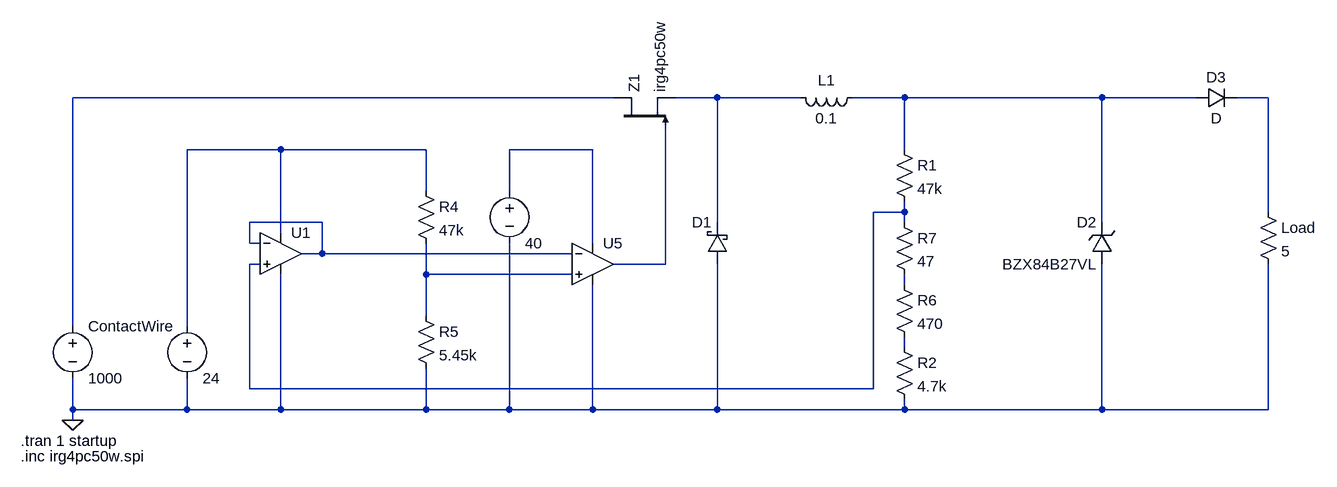
[diagram p0: schematic dc_dc_converter_simple_controller.asc]
dc_dc_converter_simple_controller.asc, the LTspice schematic file:
Version 4
SHEET 1 5120 680
WIRE 2864 -288 2032 -288
WIRE 3024 -288 2960 -288
WIRE 3152 -288 3024 -288
WIRE 3312 -288 3232 -288
WIRE 3616 -288 3312 -288
WIRE 3760 -288 3616 -288
WIRE 3872 -288 3824 -288
WIRE 2352 -208 2208 -208
WIRE 2576 -208 2352 -208
WIRE 2832 -208 2704 -208
WIRE 3312 -208 3312 -288
WIRE 2576 -144 2576 -208
WIRE 2704 -144 2704 -208
WIRE 3312 -112 3312 -128
WIRE 3312 -112 3264 -112
WIRE 3872 -112 3872 -288
WIRE 2416 -96 2304 -96
WIRE 3024 -96 3024 -288
WIRE 3312 -96 3312 -112
WIRE 3616 -96 3616 -288
WIRE 2352 -80 2352 -208
WIRE 2304 -64 2304 -96
WIRE 2320 -64 2304 -64
WIRE 2832 -64 2832 -208
WIRE 2416 -48 2416 -96
WIRE 2416 -48 2384 -48
WIRE 2800 -48 2416 -48
WIRE 2320 -32 2304 -32
WIRE 2944 -32 2944 -240
WIRE 2944 -32 2864 -32
WIRE 2576 -16 2576 -64
WIRE 2800 -16 2576 -16
WIRE 3312 0 3312 -16
WIRE 2576 48 2576 -16
WIRE 2032 64 2032 -288
WIRE 2208 64 2208 -208
WIRE 3312 96 3312 80
WIRE 2304 160 2304 -32
WIRE 3264 160 3264 -112
WIRE 3264 160 2304 160
WIRE 2032 192 2032 144
WIRE 2208 192 2208 144
WIRE 2208 192 2032 192
WIRE 2352 192 2352 -16
WIRE 2352 192 2208 192
WIRE 2576 192 2576 128
WIRE 2576 192 2352 192
WIRE 2704 192 2704 -64
WIRE 2704 192 2576 192
WIRE 2832 192 2832 0
WIRE 2832 192 2704 192
WIRE 3024 192 3024 -32
WIRE 3024 192 2832 192
WIRE 3312 192 3312 176
WIRE 3312 192 3024 192
WIRE 3616 192 3616 -32
WIRE 3616 192 3312 192
WIRE 3872 192 3872 -32
WIRE 3872 192 3616 192
WIRE 2032 208 2032 192
FLAG 2032 208 0
SYMBOL voltage 2032 48 R0
SYMATTR InstName ContactWire
SYMATTR Value 1000
SYMBOL Misc\\NIGBT 2864 -240 R270
SYMATTR InstName Z1
SYMATTR Value irg4pc50w
SYMATTR Prefix X
SYMBOL res 3296 -224 R0
SYMATTR InstName R1
SYMATTR Value 47k
SYMBOL res 3296 80 R0
SYMATTR InstName R2
SYMATTR Value 4.7k
SYMBOL ind 3248 -304 R90
WINDOW 0 5 56 VBottom 2
WINDOW 3 32 56 VTop 2
SYMATTR InstName L1
SYMATTR Value 0.1
SYMBOL schottky 3040 -32 R180
WINDOW 0 24 64 Left 2
WINDOW 3 24 0 Invisible 2
SYMATTR InstName D1
SYMATTR Value RBR30T60A
SYMATTR Description Diode
SYMATTR Type diode
SYMBOL zener 3632 -32 R180
WINDOW 0 24 64 Left 2
WINDOW 3 24 0 Left 2
SYMATTR InstName D2
SYMATTR Value BZX84B27VL
SYMATTR Description Diode
SYMATTR Type diode
SYMBOL res 3856 -128 R0
SYMATTR InstName Load
SYMATTR Value 5
SYMBOL Opamps\\UniversalOpamp2 2352 -48 R0
SYMATTR InstName U1
SYMBOL voltage 2208 48 R0
WINDOW 0 24 16 Invisible 2
SYMATTR InstName 24V
SYMATTR Value 24
SYMBOL res 2560 -160 R0
SYMATTR InstName R4
SYMATTR Value 47k
SYMBOL res 2560 32 R0
SYMATTR InstName R5
SYMATTR Value 5.45k
SYMBOL res 3296 -16 R0
SYMATTR InstName R6
SYMATTR Value 470
SYMBOL res 3296 -112 R0
SYMATTR InstName R7
SYMATTR Value 47
SYMBOL voltage 2704 -160 R0
WINDOW 0 24 16 Invisible 2
SYMATTR InstName 40
SYMATTR Value 40
SYMBOL Opamps\\UniversalOpamp2 2832 -32 R0
SYMATTR InstName U5
SYMBOL diode 3760 -272 R270
WINDOW 0 32 32 VTop 2
WINDOW 3 0 32 VBottom 2
SYMATTR InstName D3
TEXT 1952 240 Left 2 !.tran 1 startup
TEXT 1952 264 Left 2 !.inc irg4pc50w.spi

The netlist it stands for:
* dc_dc_converter_simple_controller.asc
V§ContactWire N001 0 1000
XZ1 N001 N009 N002 irg4pc50w  ; pins C G E
R1 N003 N007 47k
R2 N012 0 4.7k
L1 N003 N002 0.1
D1 0 N002 RBR30T60A
D2 0 N003 BZX84B27VL
R§Load N004 0 5
XU1 N007 N008 N005 0 N008 level.2 Avol=1Meg GBW=10Meg Slew=10Meg ilimit=25m rail=0 Vos=0 phimargin=45 en=0 enk=0 in=0 ink=0 Rin=500Meg  ; pins IN+ IN- V+ V- OUT
V§24V N005 0 24
R4 N005 N010 47k
R5 N010 0 5.45k
R6 N011 N012 470
R7 N007 N011 47
V§40 N006 0 40
XU5 N010 N008 N006 0 N009 level.2 Avol=1Meg GBW=10Meg Slew=10Meg ilimit=25m rail=0 Vos=0 phimargin=45 en=0 enk=0 in=0 ink=0 Rin=500Meg  ; pins IN+ IN- V+ V- OUT
D3 N003 N004 D
.model D D
.lib standard.dio
.tran 1 startup
.inc irg4pc50w.spi
.lib UniversalOpamps2.sub
.backanno
.end